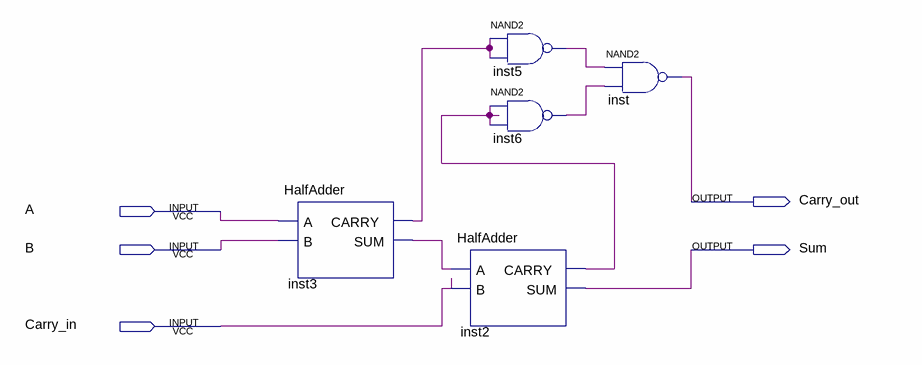
[diagram p0: schematic sheet]
// Quartus schematic FullAdder.bdf as structural Verilog: 5 symbols, 5 pins
module FullAdder (
  input  A,
  input  B,
  input  Carry_in,
  output Carry_out,
  output Sum
);

  wire inst2_carry, inst3_carry, inst3_sum, inst5_out, inst6_out;

  HalfAdder inst3 (.A(A), .B(B), .CARRY(inst3_carry), .SUM(inst3_sum));
  HalfAdder inst2 (.A(inst3_sum), .B(Carry_in), .CARRY(inst2_carry), .SUM(Sum));
  nand inst5 (inst5_out, inst3_carry, inst3_carry);
  nand inst6 (inst6_out, inst2_carry, inst2_carry);
  nand inst (Carry_out, inst5_out, inst6_out);
endmodule
